# EAGLE design 4L60E_Controller_SMD_CONNECTOR (EAGLE 9.1.3)
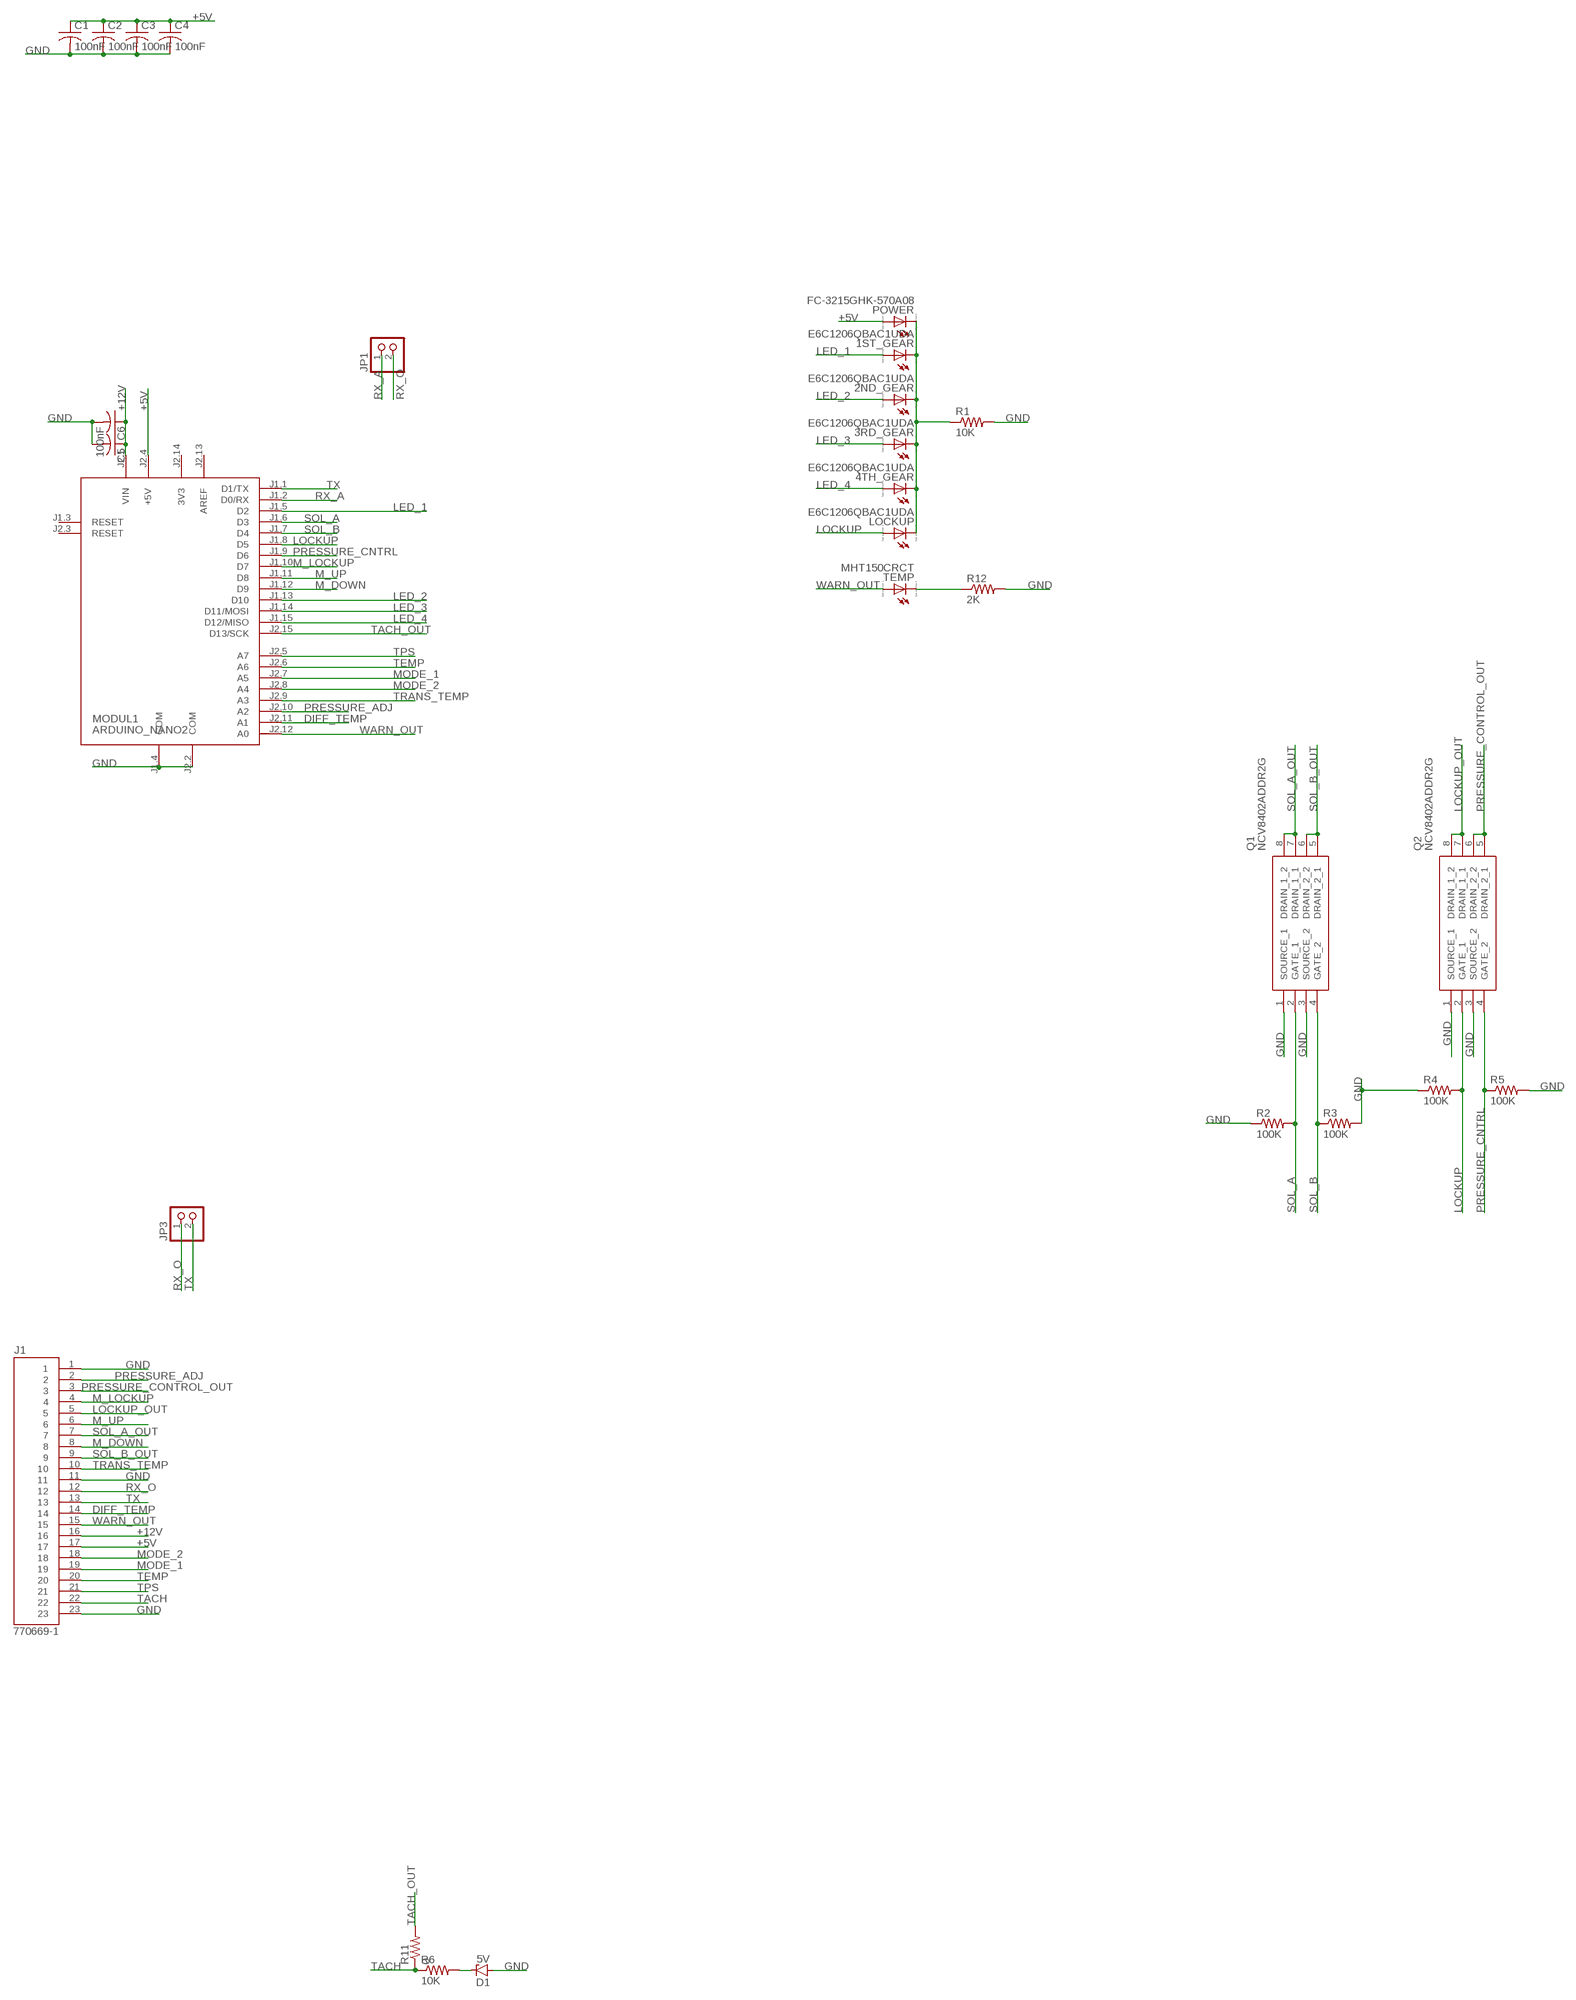
[diagram p0: schematic, sheet 1]

## Parts
1ST_GEAR  E6C1206QBAC1UDA  LED_E  [LED_1206]
2ND_GEAR  E6C1206QBAC1UDA  LED_E  [LED_1206]
3RD_GEAR  E6C1206QBAC1UDA  LED_E  [LED_1206]
4TH_GEAR  E6C1206QBAC1UDA  LED_E  [LED_1206]
C1  100nF  C-USC0805  [C0805]
C2  100nF  C-USC0805  [C0805]
C3  100nF  C-USC0805  [C0805]
C4  100nF  C-USC0805  [C0805]
C5  C-USC1206  [C1206]
C6  100nF  C-USC1206  [C1206]
D1  5V  ZENER-DIODESOT23  [SOT23]
J1  770669-1  [TE_770669-1]
JP1  PINHD-1X2  [1X02]
JP3  PINHD-1X2  [1X02]
LOCKUP  E6C1206QBAC1UDA  LED_E  [LED_1206]
MODUL1  ARDUINO_NANO2  [ARDUINO_NANO2]
POWER  FC-3215GHK-570A08  LED_E  [LED_1206]
Q1  NCV8402ADDR2G  [SOIC127P600X175-8N]
Q2  NCV8402ADDR2G  [SOIC127P600X175-8N]
R1  10K  R-US_M0805  [M0805]
R2  100K  R-US_R0805  [R0805]
R3  100K  R-US_R0805  [R0805]
R4  100K  R-US_R0805  [R0805]
R5  100K  R-US_R0805  [R0805]
R6  10K  R-US_R0805  [R0805]
R11  0  R-US_R0805  [R0805]
R12  2K  R-US_R0805  [R0805]
TEMP  MHT150CRCT  LED_E  [LED_1206]

## Nets
+5V: C1.1 C2.1 C3.1 C4.1 J1.17 MODUL1.J2.4(+5V) POWER.A
+12V: C5.1 C6.1 J1.16 MODUL1.J2.1(VIN)
DIFF_TEMP: J1.14 MODUL1.J2.11(A1)
GND: C1.2 C2.2 C3.2 C4.2 C5.2 C6.2 D1.1(A) J1.1 J1.11 J1.23 MODUL1.J1.4(COM) MODUL1.J2.2(COM) Q1.1(SOURCE_1) Q1.3(SOURCE_2) Q2.1(SOURCE_1) Q2.3(SOURCE_2) R1.2 R2.1 R3.2 R4.1 R5.2 R12.2
LED_1: 1ST_GEAR.A MODUL1.J1.5(D2)
LED_2: 2ND_GEAR.A MODUL1.J1.13(D10)
LED_3: 3RD_GEAR.A MODUL1.J1.14(D11/MOSI)
LED_4: 4TH_GEAR.A MODUL1.J1.15(D12/MISO)
LOCKUP: LOCKUP.A MODUL1.J1.8(D5) Q2.2(GATE_1) R4.2
LOCKUP_OUT: J1.5 Q2.7(DRAIN_1_1) Q2.8(DRAIN_1_2)
M_DOWN: J1.8 MODUL1.J1.12(D9)
M_LOCKUP: J1.4 MODUL1.J1.10(D7)
M_UP: J1.6 MODUL1.J1.11(D8)
MODE_1: J1.19 MODUL1.J2.7(A5)
MODE_2: J1.18 MODUL1.J2.8(A4)
N$2: D1.3(C) R6.2
N$3: R12.1 TEMP.C
N$8: 1ST_GEAR.C 2ND_GEAR.C 3RD_GEAR.C 4TH_GEAR.C LOCKUP.C POWER.C R1.1
PRESSURE_ADJ: J1.2 MODUL1.J2.10(A2)
PRESSURE_CNTRL: MODUL1.J1.9(D6) Q2.4(GATE_2) R5.1
PRESSURE_CONTROL_OUT: J1.3 Q2.5(DRAIN_2_1) Q2.6(DRAIN_2_2)
RX_A: JP1.1 MODUL1.J1.2(D0/RX)
RX_O: J1.12 JP1.2 JP3.1
SOL_A: MODUL1.J1.6(D3) Q1.2(GATE_1) R2.2
SOL_A_OUT: J1.7 Q1.7(DRAIN_1_1) Q1.8(DRAIN_1_2)
SOL_B: MODUL1.J1.7(D4) Q1.4(GATE_2) R3.1
SOL_B_OUT: J1.9 Q1.5(DRAIN_2_1) Q1.6(DRAIN_2_2)
TACH: J1.22 R6.1 R11.1
TACH_OUT: MODUL1.J2.15(D13/SCK) R11.2
TEMP: J1.20 MODUL1.J2.6(A6)
TPS: J1.21 MODUL1.J2.5(A7)
TRANS_TEMP: J1.10 MODUL1.J2.9(A3)
TX: J1.13 JP3.2 MODUL1.J1.1(D1/TX)
WARN_OUT: J1.15 MODUL1.J2.12(A0) TEMP.A
Unconnected: MODUL1.J1.3(RESET) MODUL1.J2.3(RESET)

## Power pins joined to a net without a drawn wire
3V3: MODUL1.J2.14(3V3)
AREF: MODUL1.J2.13(AREF)

## Library data of the parts
1ST_GEAR 2ND_GEAR 3RD_GEAR 4TH_GEAR LOCKUP POWER TEMP = eagle-ltspice:LED_E: LED Source: http://www.osram.convergy.de Source: www.luxeon.com Source: www.kingbright.com; SPICEMODEL: NONE; SPICEPREFIX: D; SPICETYPE: diode
C1-C4 = rcl:C-US: CAPACITOR, American symbol; SPICEPREFIX: C
C5 C6 = resistor:C-US: CAPACITOR, American symbol
D1 = diode:ZENER-DIODE: Z-Diode
J1 = 770669-1:770669-1: CONN HEADER 23POS R/A TIN BLK; AVAILABILITY: Unavailable; COMMENT: 770669-1; DESCRIPTION: AMPSEAL 23 Position Three Row Right Angle Snap Mount Pin Header; EU_ROHS_COMPLIANCE: Compliant; MF: TE Connectivity; MP: 770669-1; PACKAGE: None; PRICE: None; TE_PURCHASE_URL: https://www.te.com/usa-en/product-770669-1.html?te_bu=Cor&te_type=disp&te_campaign=seda_glo_cor-seda-global-disp-prtnr-fy19-seda-model-bom-cta_sma-317_1&elqCampaignId=32493
JP1 JP3 = pinhead:PINHD-1X2: PIN HEADER
MODUL1 = arduino:ARDUINO_NANO2: Arduino Nano2 Auto generated by modulcreator.ulp \;; ANZAHL: 2; MODUL: TRUE; STECKX0: -76200; STECKX1: 76200; STECKY0: 177800; STECKY1: 177800
Q1 Q2 = NCV8402ADDR2G:NCV8402ADDR2G: Dual Self-Protected N-Channel Power MOSFET Source: Datasheet <https://componentsearchengine.com/Datasheets/1/NCV8402ADDR2G.pdf>; DESCRIPTION: Dual Self-Protected N-Channel Power MOSFET; HEIGHT: 1.75mm; MANUFACTURER_NAME: ON Semiconductor; MANUFACTURER_PART_NUMBER: NCV8402ADDR2G; MOUSER_PART_NUMBER: 863-NCV8402ADDR2G; MOUSER_PRICE-STOCK: https://www.mouser.com/Search/Refine.aspx?Keyword=863-NCV8402ADDR2G
R1 R6 R11 R12 = resistor:R-US_: RESISTOR, American symbol
R2-R5 = rcl:R-US_: RESISTOR, American symbol; SPICEPREFIX: R

## Board
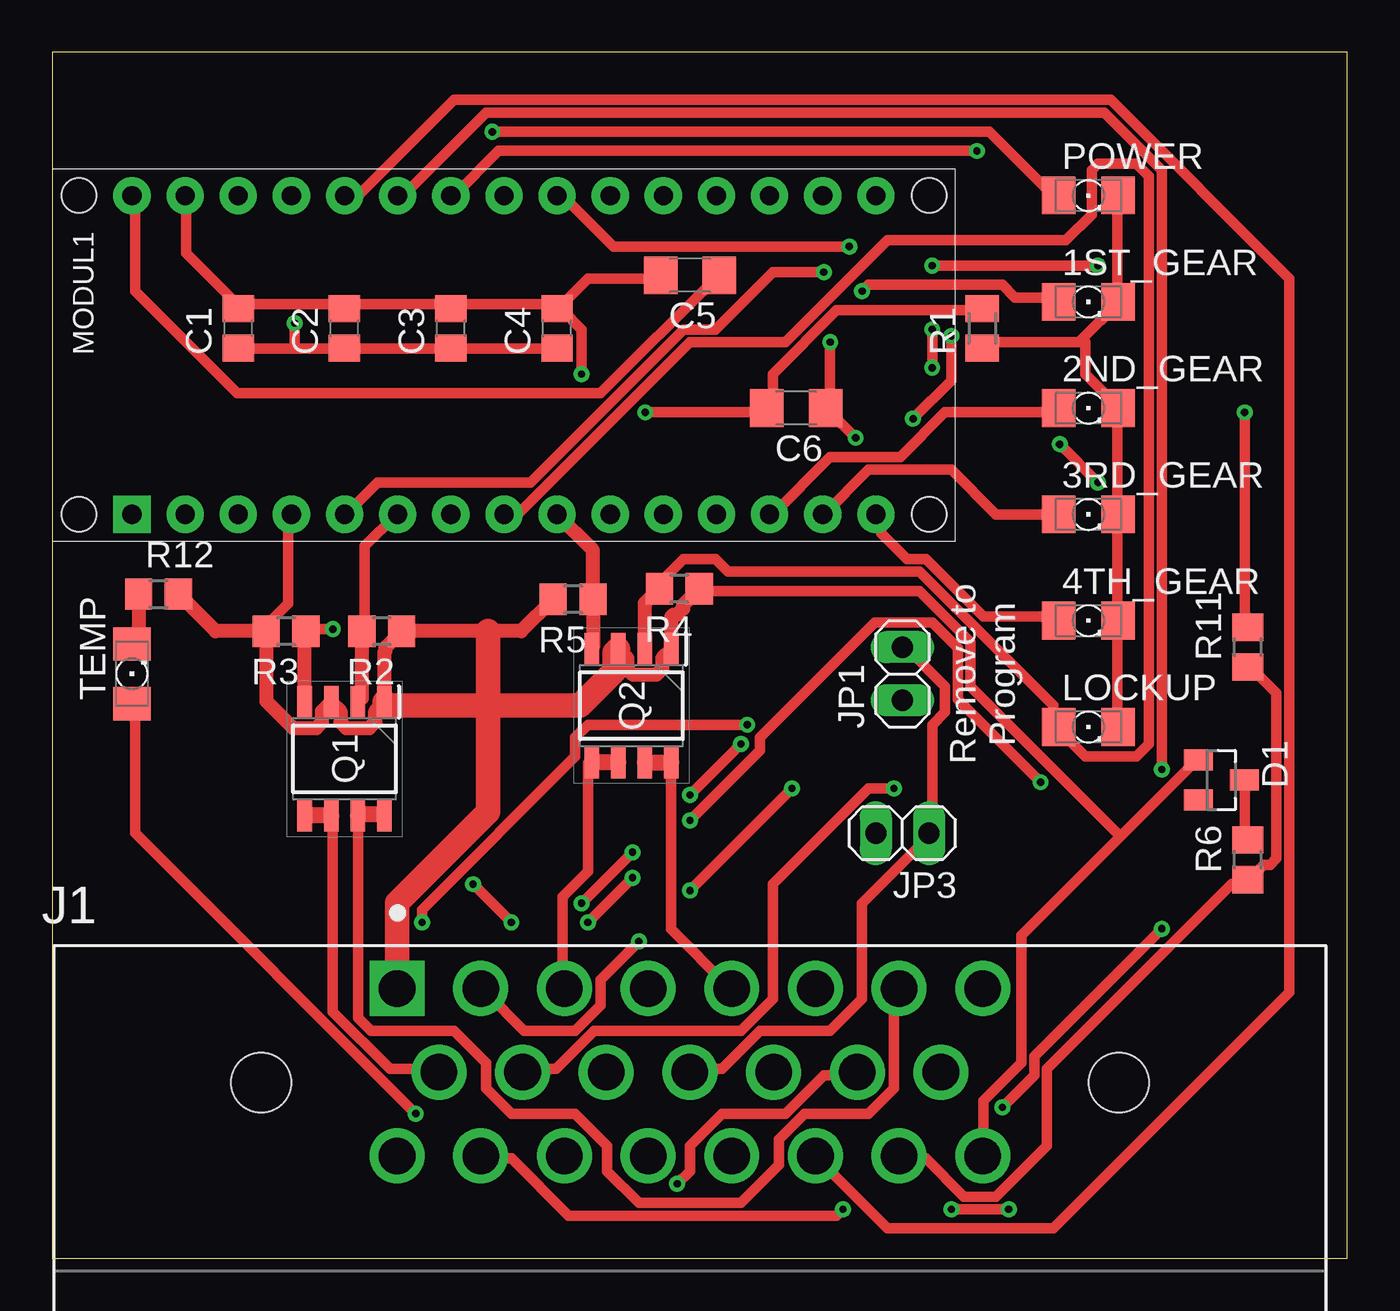
[diagram p1: board, top side]
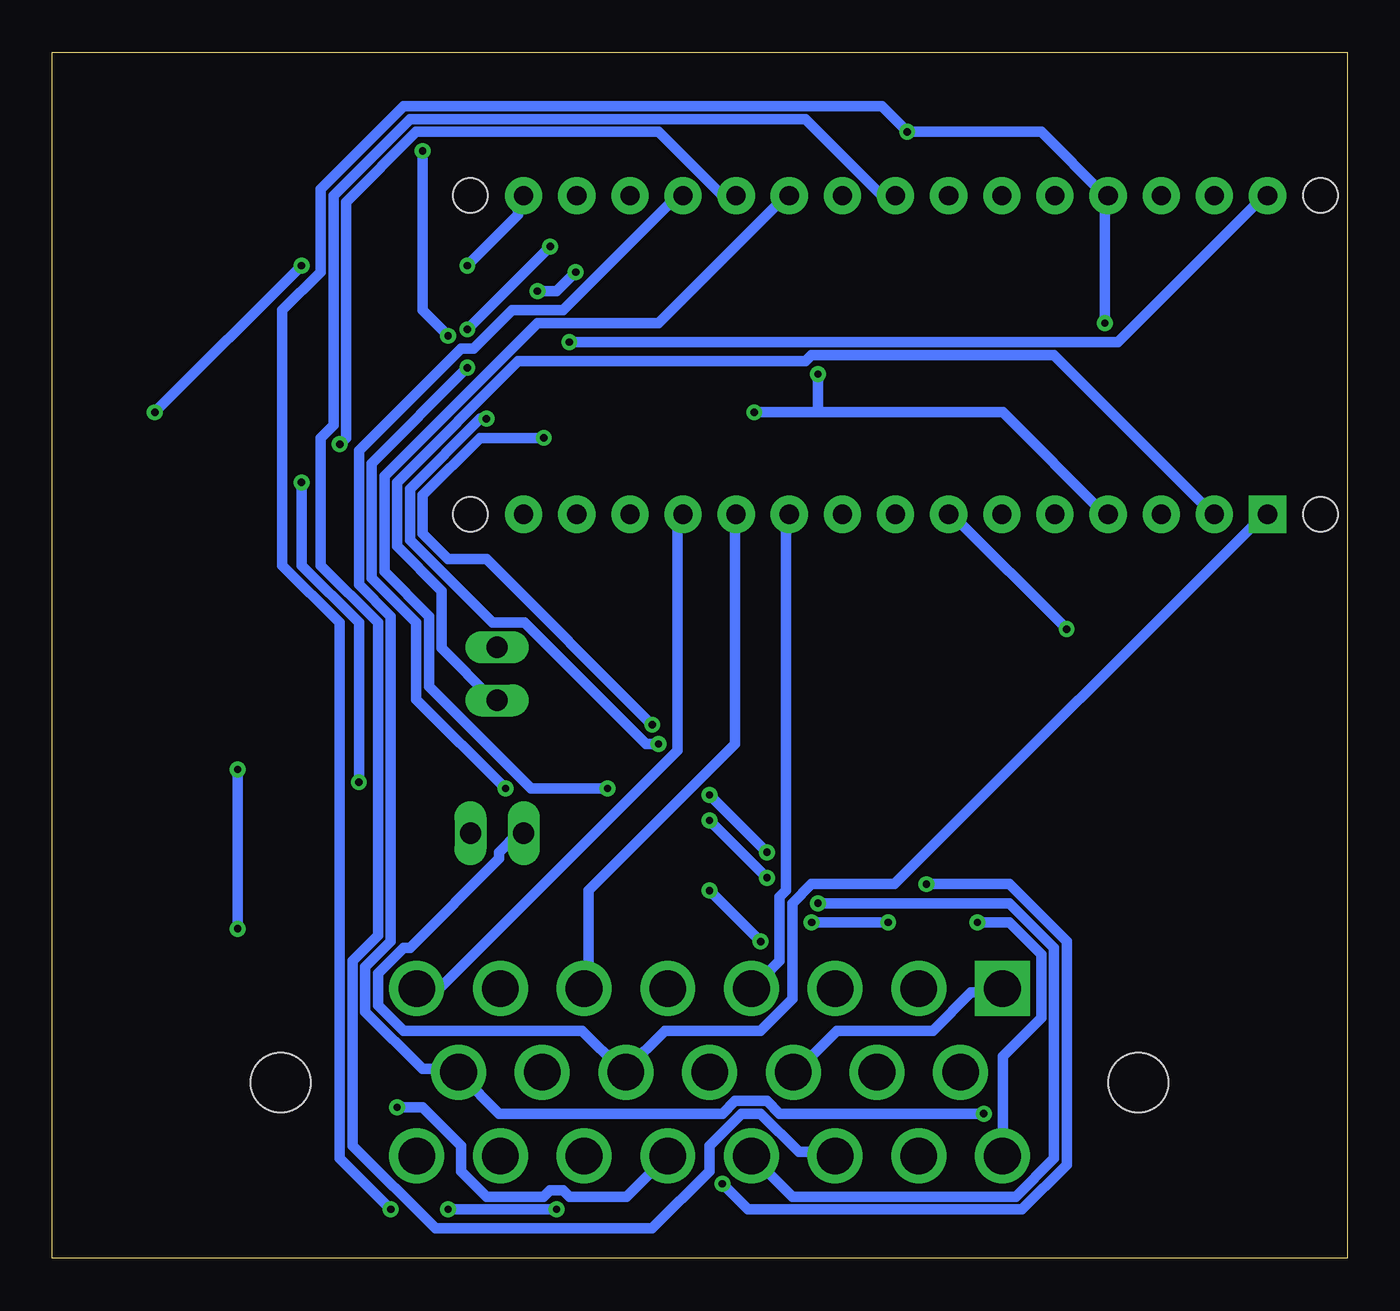
[diagram p2: board, bottom side, seen from below]

Size 61.9 x 57.65 mm. Coordinates in mm from the lower left corner, seen from the top.
Outline: 0,0 61.9,0 61.9,57.65 0,57.65 0,0
Copper layers (1*16): Top 0.035mm / dielectric 1.5mm / Bottom 0.035mm
Design rules "default *": minimum track width 20mil, minimum drill 0.35mm, track to track 4mil, track to pad 6mil, pad to pad 6mil, via to via 6mil, smd to smd 3.5mil, copper to edge 40mil, drill to drill 6mil, minimum pad ring 10mil, minimum via ring 8mil, stop-mask expansion 4mil, vias tented up to drill 0mil, thermal gap 10mil

### Footprints (pad centres in the part's own frame; a part is rotated, then mirrored left to right if it is on the bottom)
LED_1206 = smd 1.6 x 1.803: A -1.422,0; C 1.422,0
C0805 = smd 1.3 x 1.5: 1 -0.95,0; 2 0.95,0
C1206 = smd 1.6 x 1.8: 1 -1.4,0; 2 1.4,0
SOT23 = smd 1 x 1.4: 1 -0.95,-1.1; 2 0.95,-1.1; 3 0,1.1
TE_770669-1 = drill 1.75 square: 1 -14,4 | drill 1.75: 2 -10,4; 3 -6,4; 4 -2,4; 5 2,4; 6 6,4; 7 10,4; 8 14,4; 9 -12,0; 10 -8,0; 11 -4,0; 12 0,0; 13 4,0; 14 8,0; 15 12,0; 16 -14,-4; 17 -10,-4; 18 -6,-4; 19 -2,-4; 20 2,-4; 21 6,-4; 22 10,-4; 23 14,-4 | hole 2.85: -20.5,-0.5; 20.5,-0.5
1X02 = drill 1.016 long: 1 -1.27,0; 2 1.27,0
ARDUINO_NANO2 = drill 0.914 pad 1.778 square: J1.1 -7.62,17.78 | drill 0.914 pad 1.778: J1.2 -7.62,15.24; J1.3 -7.62,12.7; J1.4 -7.62,10.16; J1.5 -7.62,7.62; J1.6 -7.62,5.08; J1.7 -7.62,2.54; J1.8 -7.62,0; J1.9 -7.62,-2.54; J1.10 -7.62,-5.08; J1.11 -7.62,-7.62; J1.12 -7.62,-10.16; J1.13 -7.62,-12.7; J1.14 -7.62,-15.24; J1.15 -7.62,-17.78; J2.1 7.62,17.78; J2.2 7.62,15.24; J2.3 7.62,12.7; J2.4 7.62,10.16; J2.5 7.62,7.62; J2.6 7.62,5.08; J2.7 7.62,2.54; J2.8 7.62,0; J2.9 7.62,-2.54; J2.10 7.62,-5.08; J2.11 7.62,-7.62; J2.12 7.62,-10.16; J2.13 7.62,-12.7; J2.14 7.62,-15.24; J2.15 7.62,-17.78 | hole 1.651: -7.62,-20.32; 7.62,-20.32; 7.62,20.32; -7.62,20.32
SOIC127P600X175-8N = smd 1.525 x 0.7: 1 -2.712,1.905; 2 -2.712,0.635; 3 -2.712,-0.635; 4 -2.712,-1.905; 5 2.712,-1.905; 6 2.712,-0.635; 7 2.712,0.635; 8 2.712,1.905
M0805 = smd 1.3 x 1.6: 1 -0.95,0; 2 0.95,0
R0805 = smd 1.3 x 1.5: 1 -0.95,0; 2 0.95,0

### Placement (x,y rotation side)
1ST_GEAR  49.53,45.72 0 top
2ND_GEAR  49.53,40.64 0 top
3RD_GEAR  49.53,35.56 0 top
4TH_GEAR  49.53,30.48 0 top
C1  8.89,44.45 90 top
C2  13.97,44.45 90 top
C3  19.05,44.45 90 top
C4  24.13,44.45 90 top
C5  30.48,46.99 180 top
C6  35.56,40.64 180 top
D1  55.88,22.86 270 top
J1  30.48,8.89 0 top
JP1  40.64,27.94 90 top
JP3  40.64,20.32 180 top
LOCKUP  49.53,25.4 0 top
MODUL1  21.59,43.18 90 top
POWER  49.53,50.8 0 top
Q1  13.97,23.88 270 top
Q2  27.69,26.42 270 top
R1  44.45,44.45 90 top
R2  15.75,29.97 180 top
R3  11.18,29.97 180 top
R4  29.97,32 180 top
R5  24.89,31.5 180 top
R6  57.15,19.05 90 top
R11  57.15,29.21 90 top
R12  5.08,31.75 0 top
TEMP  3.81,27.94 90 top

### Tracks (layer width: path | path; a pad name or v marks a point on that pad's centre or on a via)
+5V  (via drill 0.35)
  Top 0.508: 11.58,43.48 13.72,43.48 C2.1 14.02,43.48 18.9,43.48 C3.1 19.2,43.48 24.08,43.48 C4.1 | 11.58,43.48 9.14,43.48 C1.1 | v21.03,53.85 44.81,53.85 47.85,50.8 POWER.A | v37.8,2.34 37.49,2.03 24.69,2.03 21.95,4.77 20.73,4.77 J1.17 | v45.72,2.34 v42.98,2.34 | v11.58,44.7 11.58,43.48
  Bottom 0.508: 11.58,50.8 14.63,53.85 v21.03,53.85 22.25,55.07 45.11,55.07 49.07,51.11 49.07,47.14 50.9,45.31 50.9,33.12 48.16,30.38 48.16,4.77 v45.72,2.34 | v42.98,2.34 v37.8,2.34 | 11.58,50.8 v11.58,44.7 | 11.58,50.8 MODUL1.J2.4
+12V  (via drill 0.35)
  Top 0.508: C5.1 31.7,46.84 26.21,41.35 8.84,41.35 3.96,46.23 3.96,50.8 MODUL1.J2.1 | v37.19,43.79 37.19,40.74 C6.1 37.19,40.44 v38.41,39.22 | v17.68,16.05 17.68,16.66 24.99,23.98 24.99,24.89 25.6,25.5 v33.22,25.5
  Bottom 0.508: v37.19,43.79 10.97,43.79 3.96,50.8 MODUL1.J2.1 | v17.68,16.05 16.15,16.05 14.63,14.53 14.63,11.48 16.46,9.65 16.46,5.08 J1.16 | v33.22,25.5 41.15,33.43 42.98,33.43 44.2,34.65 44.2,36.47 41.45,39.22 v38.41,39.22
DIFF_TEMP  (via drill 0.35)
  Top 0.508: v49.99,37.08 v48.16,38.91 | v47.24,22.76 43.28,26.72 43.28,29.16 42.06,30.38 39.32,30.38 33.83,24.89 33.83,24.28 v30.48,20.93 | v25.6,16.05 v27.74,18.19 | v20.12,17.88 v21.95,16.05 | v29.87,3.56 30.48,4.17 30.48,5.38 32,6.91 35.05,6.91 36.88,8.74 38.41,8.74 J1.14
  Bottom 0.508: MODUL1.J2.11 29.87,50.8 32.92,53.85 44.5,53.85 47.85,50.5 47.85,39.22 v48.16,38.91 | v49.99,37.08 49.99,33.12 47.24,30.38 v47.24,22.76 | v27.74,18.19 v30.48,20.93 | v21.95,16.05 v25.6,16.05 | v20.12,17.88 16.15,17.88 13.41,15.14 13.41,4.47 15.54,2.34 28.65,2.34 v29.87,3.56
GND  (via drill 0.35)
  Top 0.508: 51.05,20.17 46.33,15.44 46.33,9.35 44.5,7.52 44.5,5.08 J1.23 | 51.05,20.17 54.56,23.67 D1.1 | C4.2 24.08,45.62 19.2,45.62 C3.2 18.9,45.62 14.02,45.62 C2.2 13.72,45.62 9.14,45.62 C1.2 8.84,45.62 6.4,48.06 6.4,50.8 MODUL1.J2.2 | C5.2 28.96,46.84 25.6,46.84 24.38,45.62 C4.2 | R1.2 44.2,45.31 37.49,45.31 34.44,42.27 34.44,40.74 C6.2 34.14,40.44 v28.35,40.44 | MODUL1.J1.4 11.28,35.56 11.28,31.29 10.06,30.07 R3.2 | v25.3,42.27 25.3,44.4 24.38,45.31 C4.2 | 51.05,20.17 43.89,27.33 43.89,29.46 41.45,31.9 31.09,31.9 R4.1
  Top 0.66: R5.2 22.42,29.97 20.83,29.97 R2.1 15.93,29.2 15.93,29.02 15.88,28.97 Q1.1 15.44,26.15 15.44,25.63 15.15,25.34 14.05,25.34 13.77,25.63 13.77,26.15 Q1.3 12.9,26.15 12.9,25.63 12.62,25.34 11.52,25.34 10.23,26.63 R3.2 7.81,29.97 R12.2 | R4.1 30.16,31.24 30.16,31.05 29.87,30.77 29.69,30.77 29.59,30.67 Q2.1 29.15,28.69 29.15,28.17 28.87,27.88 27.77,27.88 27.49,28.17 27.49,28.69 Q2.3
  Top 1.168: J1.1 16.48,16.99 20.83,21.34 20.83,26.42 | 20.83,26.42 20.83,29.97 | Q1.1 16.05,26.42 20.83,26.42 | Q2.3 26.87,28.95 26.87,28.06 25.22,26.42 20.83,26.42
  Bottom 0.508: J1.1 16.76,12.7 17.98,12.7 19.81,10.87 24.38,10.87 26.21,9.04 J1.11 | 25.3,40.44 16.46,40.44 11.58,35.56 MODUL1.J1.4 | 25.3,40.44 v28.35,40.44 | 25.3,40.44 v25.3,42.27
LED_1  (via drill 0.35)
  Top 0.508: v38.71,46.23 39.01,46.53 45.41,46.53 46.02,45.92 47.85,45.92 1ST_GEAR.A | v36.88,47.14 34.44,47.14 31.7,44.4 30.18,44.4 22.86,37.08 15.54,37.08 14.02,35.56 MODUL1.J1.5
  Bottom 0.508: v38.71,46.23 37.8,46.23 v36.88,47.14
LED_2
  Top 0.508: 2ND_GEAR.A 47.85,40.44 42.67,40.44 40.54,38.3 37.19,38.3 34.44,35.56 MODUL1.J1.13
LED_3
  Top 0.508: 3RD_GEAR.A 45.11,35.56 42.98,37.69 39.01,37.69 36.88,35.56 MODUL1.J1.14
LED_4
  Top 0.508: 4TH_GEAR.A 47.85,30.68 44.5,30.68 41.76,33.43 40.84,33.43 39.62,34.65 39.62,35.56 MODUL1.J1.15
LOCKUP
  Top 0.508: R4.2 28.96,32.21 30.18,33.43 31.7,33.43 32.31,32.82 41.45,32.82 47.85,26.42 47.85,25.5 LOCKUP.A 48.16,25.2 49.38,23.98 51.82,23.98 52.43,24.59 52.43,51.71 51.82,52.32 49.99,52.32 49.68,52.02 49.68,49.89 48.46,48.67 39.93,48.67 35.05,43.79 30.48,43.79 22.25,35.56 MODUL1.J1.8
  Top 0.66: R4.2 28.32,31.3 Q2.2
LOCKUP_OUT
  Top 0.508: 29.57,23.67 28.35,23.67 Q2.7 | 29.57,23.67 29.57,15.75 32.31,13 J1.5 | 29.57,23.67 Q2.8
  Top 0.762: Q2.7 Q2.8
M_DOWN
  Bottom 0.508: MODUL1.J1.12 32,35.56 32,24.28 43.28,13 44.2,13 J1.8
M_LOCKUP
  Bottom 0.508: MODUL1.J1.10 26.82,35.56 26.82,17.58 27.13,17.27 27.13,14.22 28.35,13 J1.4
M_UP
  Bottom 0.508: MODUL1.J1.11 29.26,35.56 29.26,24.59 36.27,17.58 36.27,13 J1.6
MODE_1  (via drill 0.35)
  Top 0.508: v44.2,52.93 21.34,52.93 19.2,50.8 MODUL1.J2.7 | v42.98,44.09 42.98,41.96 v41.15,40.13 | v30.48,22.15 v32.92,24.59 | v25.3,16.97 v27.74,19.41
  Bottom 0.508: v44.2,52.93 44.2,45.31 v42.98,44.09 | v41.15,40.13 41.45,40.13 44.81,36.78 44.81,34.34 40.84,30.38 39.32,30.38 33.53,24.59 v32.92,24.59 | v27.74,19.41 v30.48,22.15 | v25.3,16.97 16.15,16.97 14.02,14.83 14.02,4.77 15.85,2.95 26.52,2.95 28.35,4.77 J1.19
MODE_2
  Bottom 0.508: MODUL1.J2.8 22.25,50.8 25.91,54.46 44.81,54.46 48.46,50.8 48.46,39.83 49.07,39.22 49.07,33.12 46.33,30.38 46.33,15.44 47.55,14.22 47.55,5.38 43.59,1.42 33.22,1.42 30.48,4.17 30.48,5.38 28.96,6.91 28.04,6.91 26.21,5.08 24.69,5.08 J1.18
N$2
  Top 0.508: D1.3 57,22.76 57,20.02 R6.2
N$3
  Top 0.66: R12.1 4.13,29.68 TEMP.C
N$8
  Top 0.508: 49.23,43.94 50.9,45.62 1ST_GEAR.C 50.9,45.92 50.9,50.8 POWER.C | 49.23,43.94 49.07,43.79 44.5,43.79 R1.1 | LOCKUP.C 50.9,25.5 50.9,30.38 4TH_GEAR.C 50.9,30.68 50.9,35.56 | 50.9,35.56 50.9,40.44 2ND_GEAR.C 50.9,40.74 49.38,42.27 49.38,43.79 49.23,43.94 | 50.9,35.56 3RD_GEAR.C
PRESSURE_ADJ  (via drill 0.35)
  Top 0.508: v30.48,17.58 v35.36,22.45 | v28.04,15.14 26.21,13.31 26.21,12.09 24.99,10.87 22.55,10.87 20.73,12.7 J1.2
  Bottom 0.508: v35.36,22.45 39.01,22.45 43.89,27.33 43.89,30.68 46.02,32.82 46.02,37.39 38.71,44.7 32.92,44.7 26.82,50.8 MODUL1.J2.10 | v28.04,15.14 v30.48,17.58
PRESSURE_CNTRL
  Top 0.66: Q2.4 25.84,29.19 R5.1 25.84,33.85 MODUL1.J1.9
PRESSURE_CONTROL_OUT
  Top 0.508: Q2.5 25.6,23.67 25.6,18.49 24.38,17.27 24.38,13 J1.3
  Top 0.762: Q2.6 Q2.5
RX_A
  Bottom 0.508: JP1.1 40.84,26.72 43.28,29.16 43.28,31.9 45.41,34.04 45.41,37.08 39.62,42.88 25.91,42.88 25.6,43.18 14.02,43.18 6.4,35.56 MODUL1.J1.2
RX_O
  Top 0.508: 42.06,20.32 42.06,25.5 42.67,26.11 42.67,27.33 40.84,29.16 JP1.2 | 42.06,20.32 38.71,16.97 38.71,12.39 37.19,10.87 33.83,10.87 32,9.04 30.48,9.04 J1.12 | 42.06,20.32 JP3.1
SOL_A
  Top 0.508: R2.2 14.94,30.07 14.94,34.04 16.46,35.56 MODUL1.J1.6
  Top 0.66: R2.2 14.8,26.78 Q1.2
SOL_A_OUT
  Top 0.508: 15.85,21.23 Q1.8 | Q1.7 14.63,20.93 14.63,11.48 15.24,10.87 19.2,10.87 20.73,9.35 20.73,8.13 21.95,6.91 24.99,6.91 26.52,5.38 26.52,4.17 28.04,2.64 32.92,2.64 34.75,4.47 34.75,5.69 35.97,6.91 39.01,6.91 40.23,8.13 40.23,12.7 J1.7
  Top 0.762: Q1.7 14.68,21.23 15.85,21.23
SOL_B  (via drill 0.35)
  Top 0.508: v13.41,30.07 12.19,30.07 R3.1
  Top 0.66: Q1.4 12.06,29.91 R3.1
  Bottom 0.508: v13.41,30.07 18.9,35.56 MODUL1.J1.7
SOL_B_OUT
  Top 0.508: Q1.6 13.41,20.93 13.41,11.79 16.15,9.04 18.29,9.04 J1.9
  Top 0.762: Q1.6 Q1.5
TACH
  Top 0.508: R11.1 57.3,28.24 58.52,27.03 58.52,19.1 58.22,18.8 57.91,18.8 57.3,18.19 R6.1 57,17.88 56.39,17.88 47.55,9.04 47.55,5.38 45.11,2.95 43.59,2.95 41.76,4.77 40.54,4.77 J1.22
TACH_OUT  (via drill 0.35)
  Top 0.508: v57,40.44 57,30.38 R11.2 | v42.06,47.45 v49.99,47.45
  Bottom 0.508: v49.99,47.45 v57,40.44 | v42.06,47.45 39.62,49.89 39.62,50.8 MODUL1.J2.15
TEMP  (via drill 0.35)
  Top 0.508: v53.03,23.37 53.03,52.02 50.29,54.76 20.73,54.76 16.76,50.8 MODUL1.J2.6 | v53.03,15.75 46.94,9.65 46.94,8.74 v45.41,7.21
  Bottom 0.508: v53.03,15.75 v53.03,23.37 | v45.41,7.21 44.2,7.21 42.37,5.38 42.37,4.17 41.15,2.95 38.41,2.95 38.1,3.25 37.49,3.25 37.19,2.95 34.44,2.95 32.61,4.77 J1.20
TPS
  Top 0.508: MODUL1.J2.5 14.63,50.8 19.2,55.37 50.6,55.37 59.13,46.84 59.13,12.7 47.85,1.42 39.93,1.42 36.58,4.77 J1.21
TRANS_TEMP  (via drill 0.35)
  Top 0.508: v38.1,48.36 26.82,48.36 24.38,50.8 MODUL1.J2.9 | v42.06,42.57 v42.06,44.4 | v40.23,22.45 39.01,22.45 34.44,17.88 34.44,12.39 32.92,10.87 25.91,10.87 24.08,9.04 22.55,9.04 J1.10
  Bottom 0.508: v42.06,44.4 v38.1,48.36 | v42.06,42.57 46.63,38 46.63,32.51 44.5,30.38 44.5,26.72 v40.23,22.45
TX
  Bottom 0.508: JP3.2 39.62,20.32 40.54,19.41 40.54,19.1 44.81,14.83 45.11,14.83 46.33,13.61 46.33,12.09 45.11,10.87 36.58,10.87 34.75,9.04 J1.13 34.44,9.04 32.61,10.87 28.04,10.87 26.52,12.39 26.52,16.97 25.6,17.88 21.64,17.88 3.96,35.56 MODUL1.J1.1
WARN_OUT  (via drill 0.35)
  Top 0.508: v17.37,6.91 3.96,20.32 3.96,26.42 TEMP.A
  Bottom 0.508: v17.37,6.91 27.13,6.91 27.74,7.52 29.26,7.52 29.87,6.91 40.54,6.91 42.37,8.74 J1.15 42.67,9.04 44.2,9.04 46.94,11.79 46.94,13.92 45.72,15.14 45.72,30.68 47.24,32.21 47.24,38.61 42.37,43.48 41.76,43.48 39.93,45.31 37.49,45.31 32,50.8 MODUL1.J2.12

### Text on the board
tNames: Remove to / Program